# EAGLE schematic Electrical (EAGLE 9.4.0)
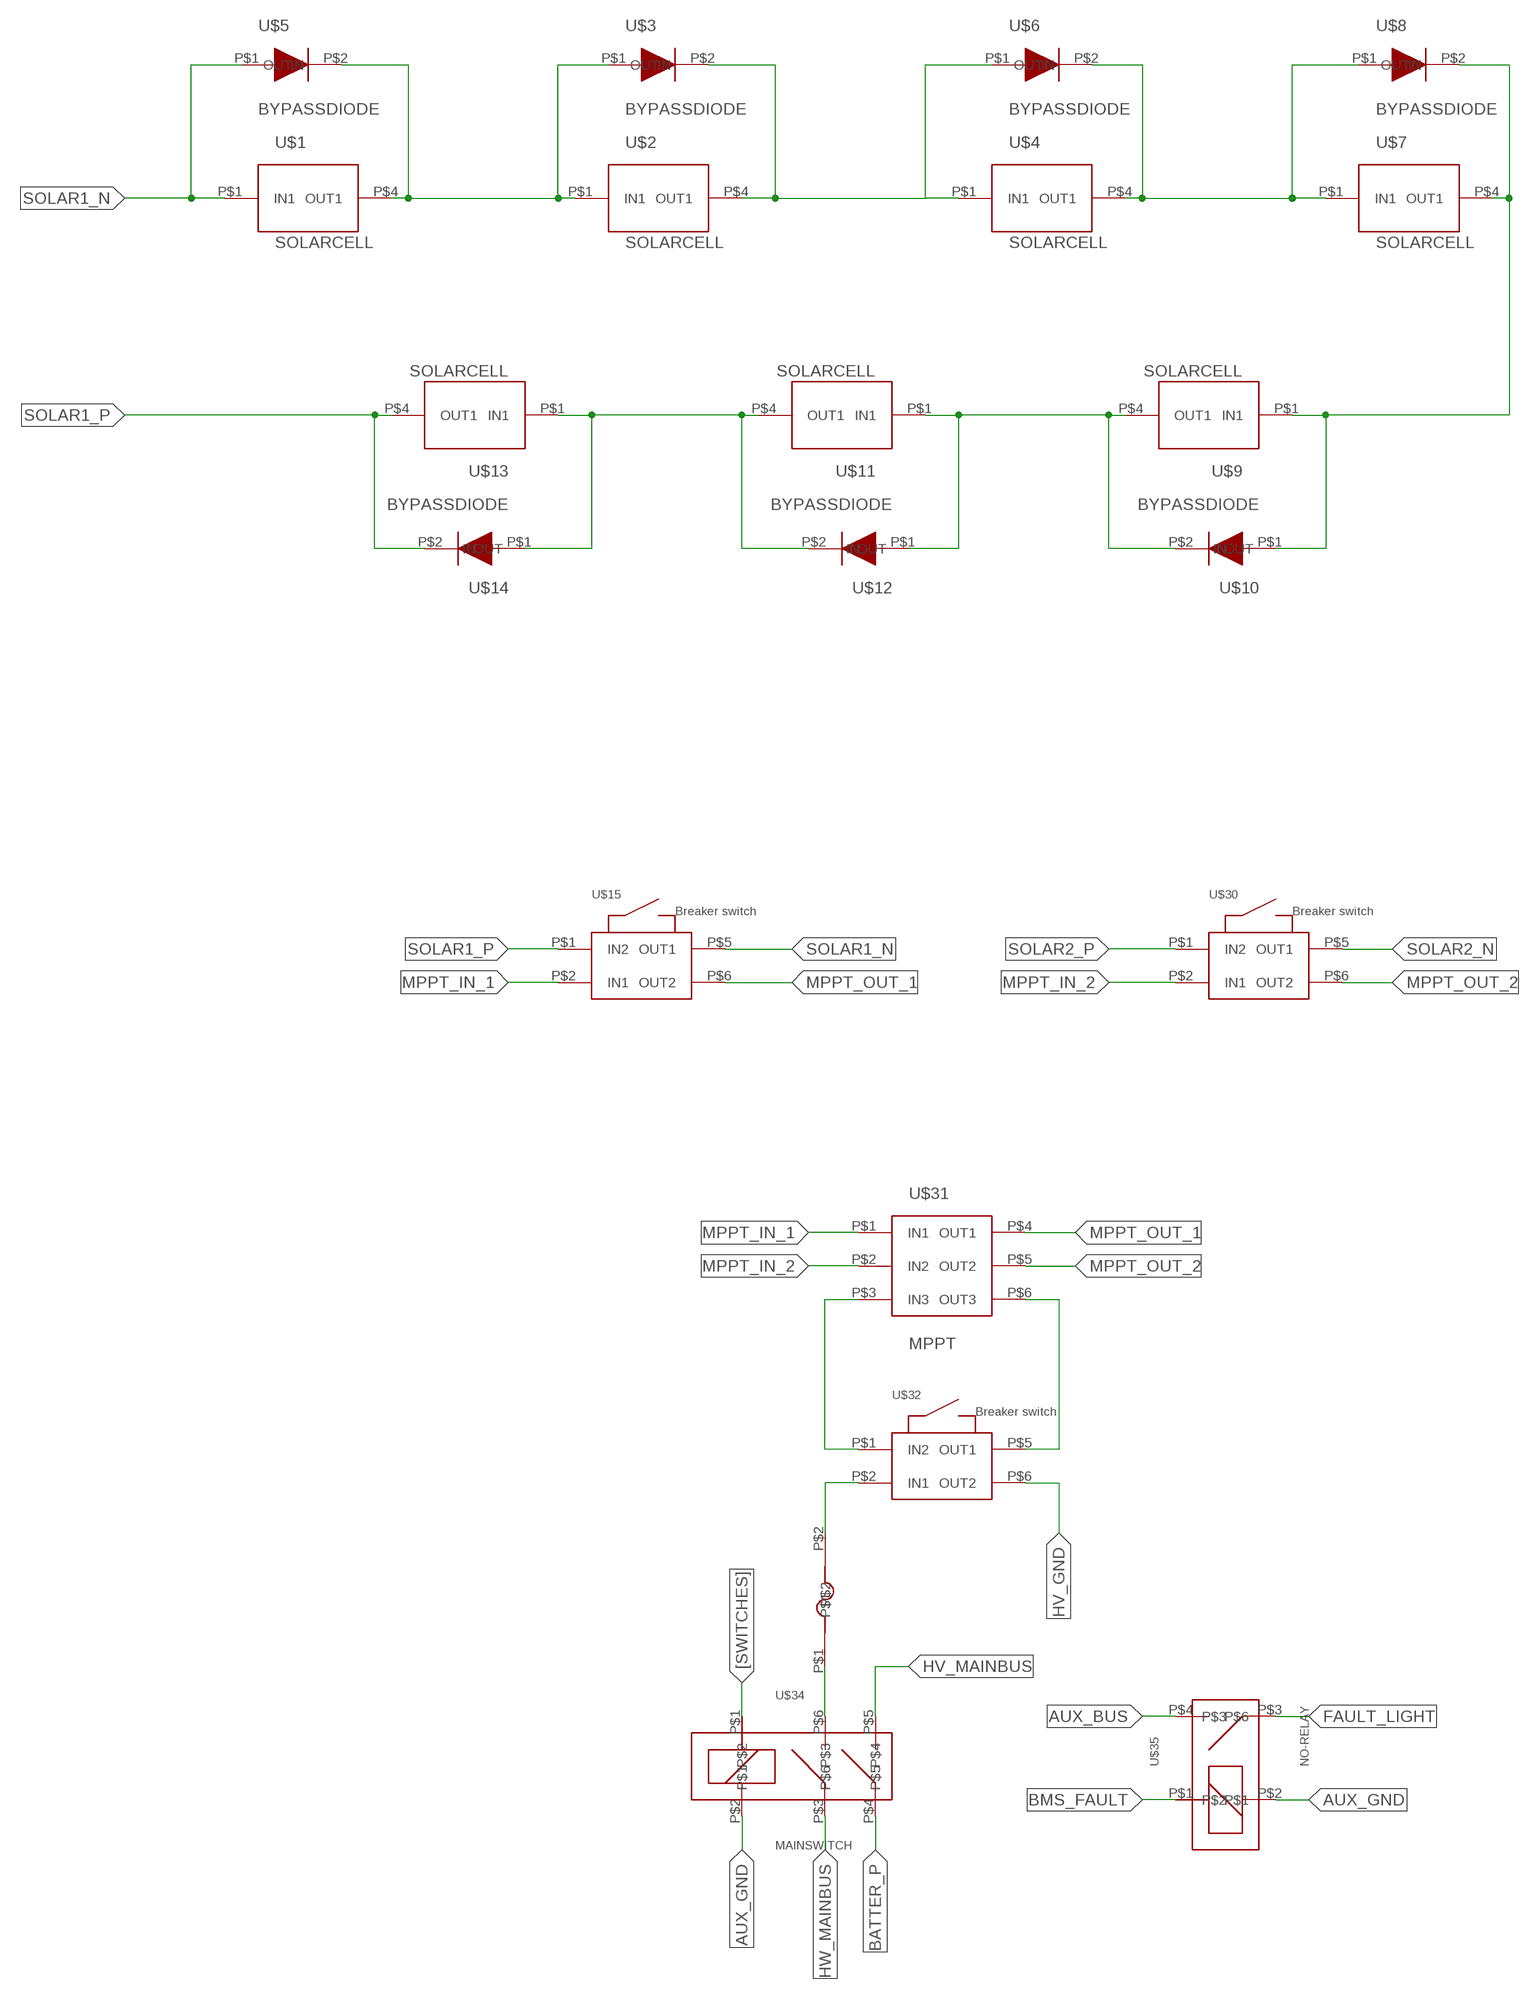
[diagram p0: schematic, sheet 1, part 1 of 3]
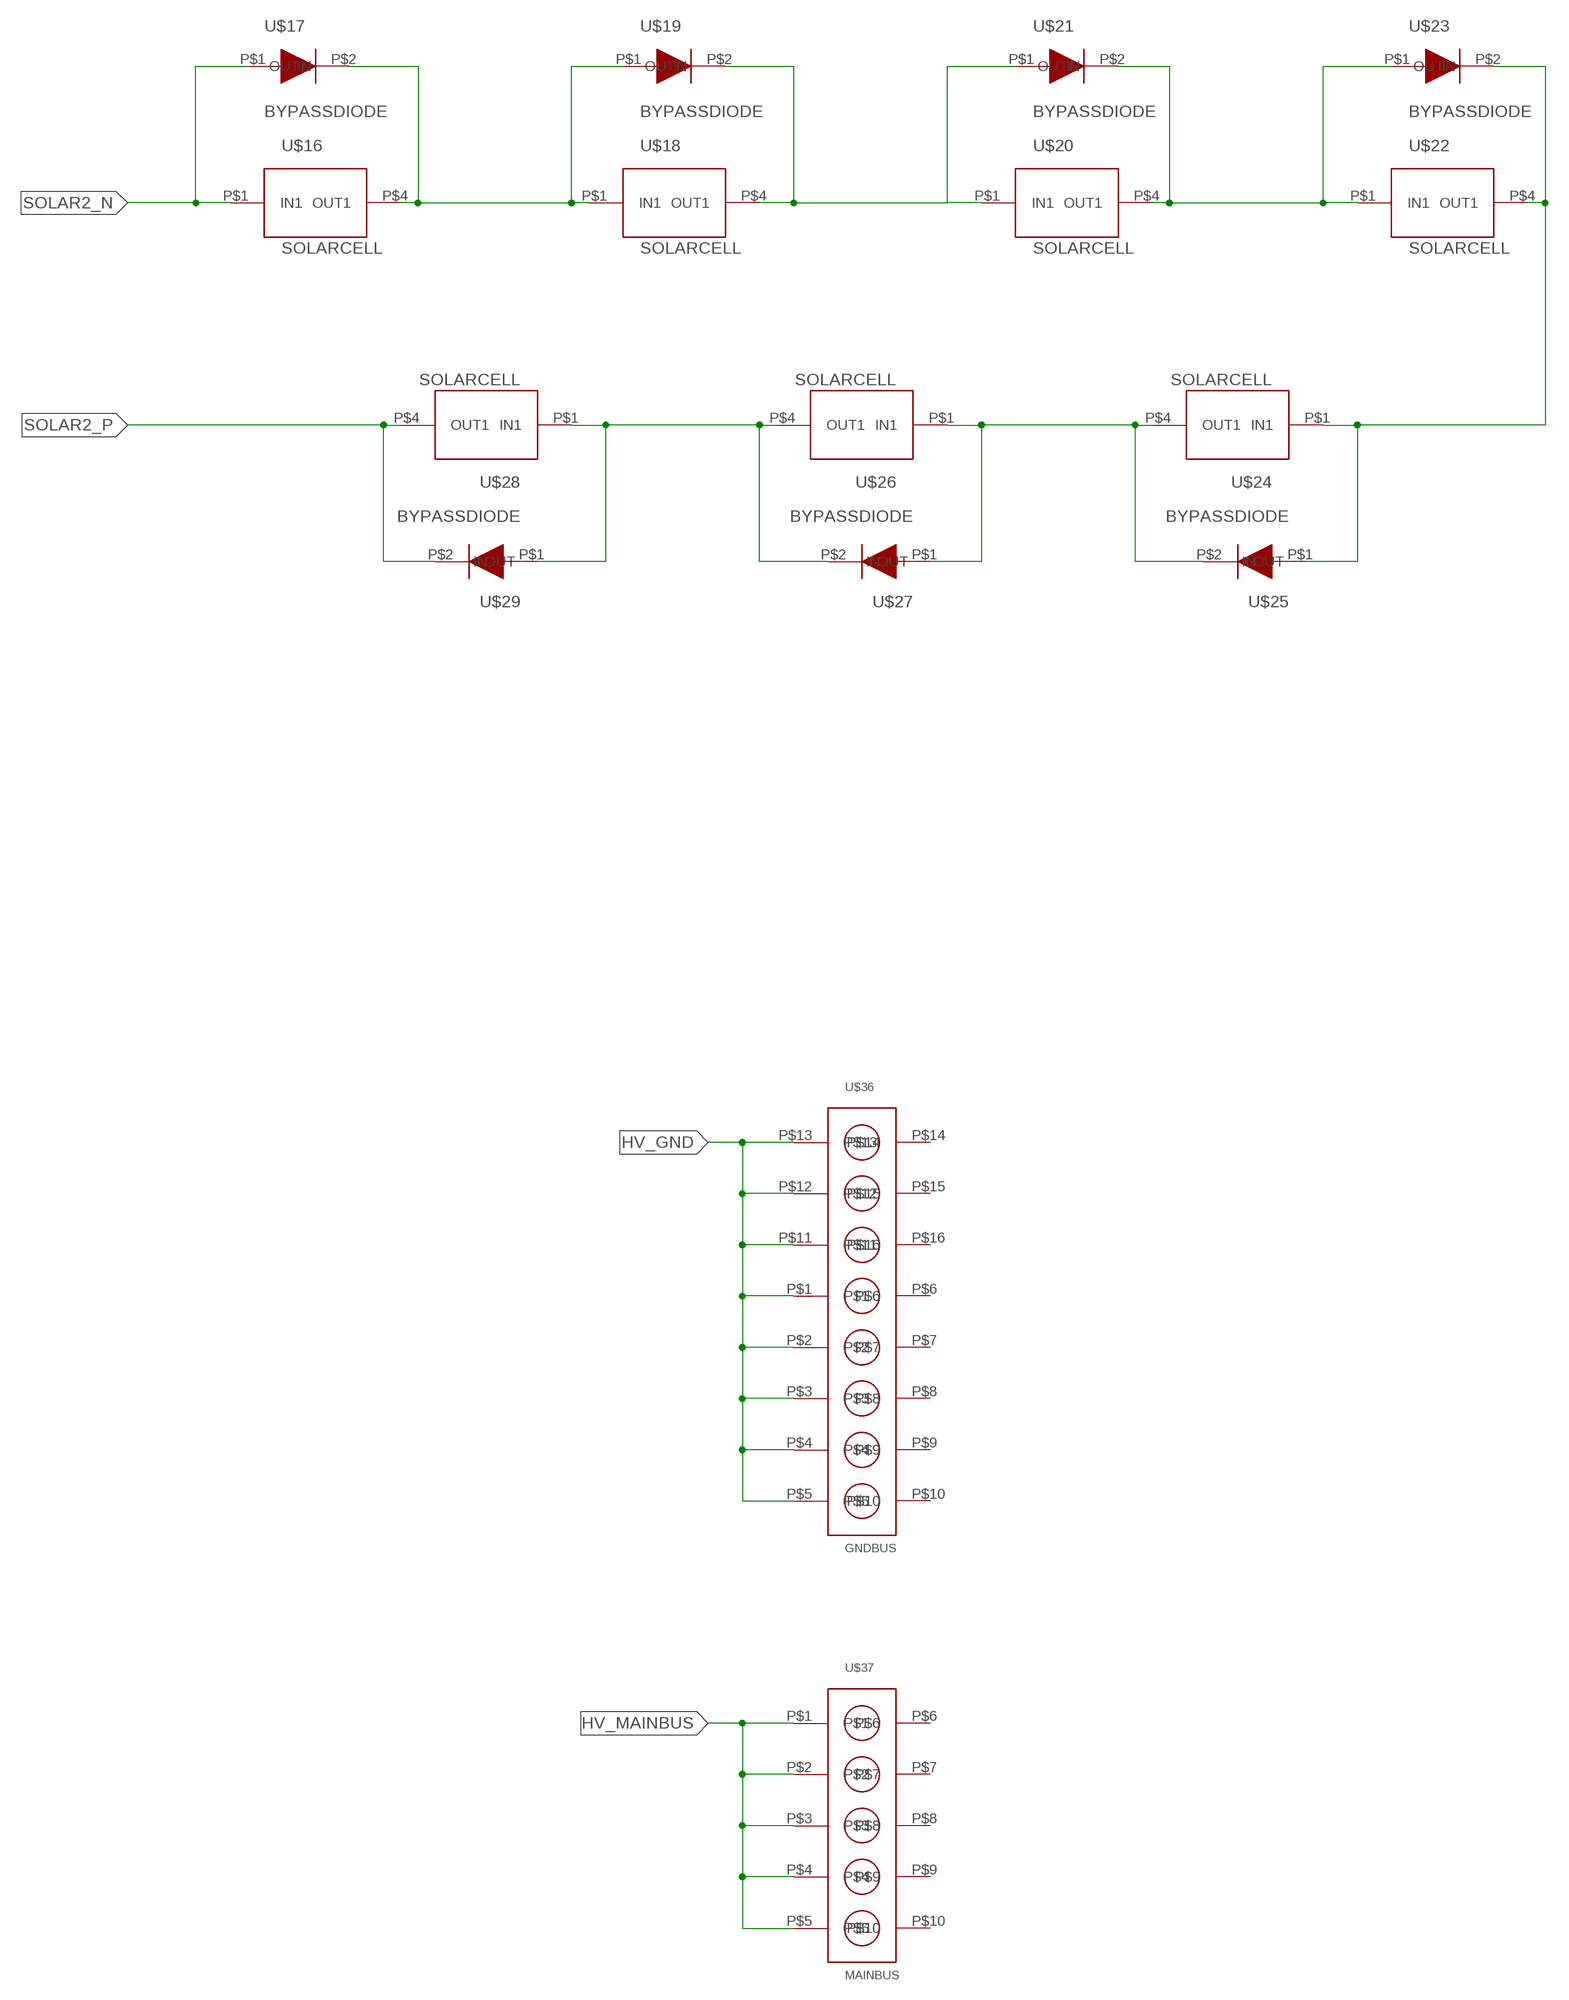
[diagram p1: schematic, sheet 1, part 2 of 3]
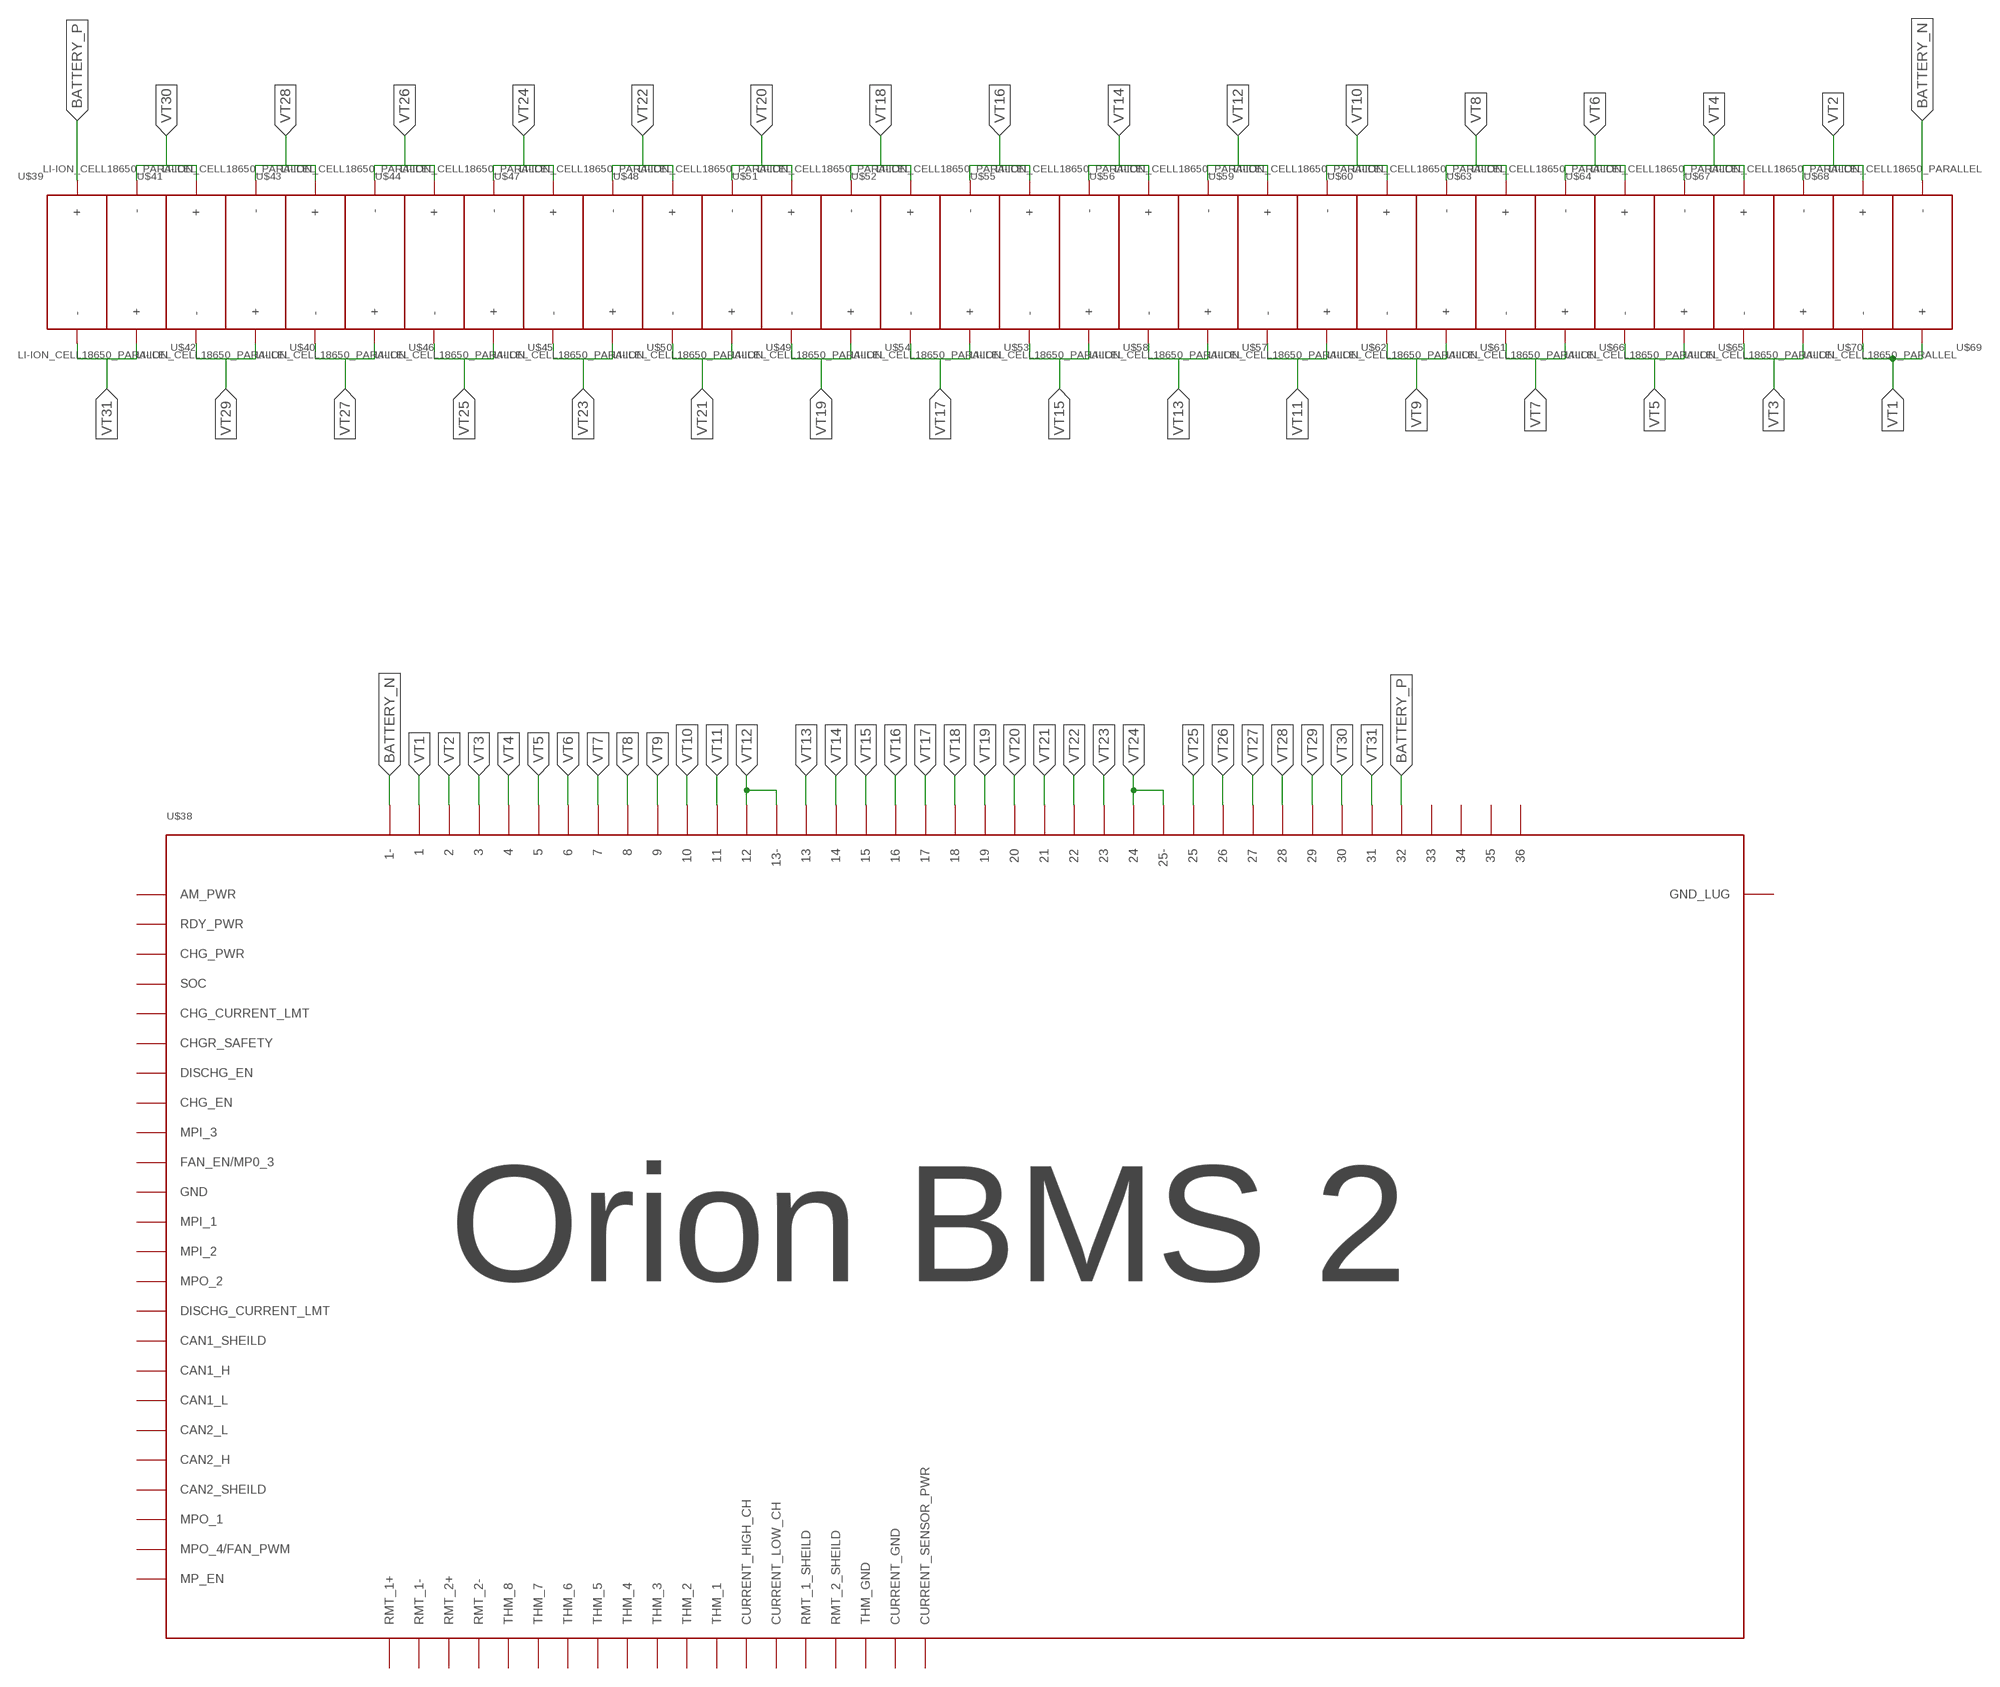
[diagram p2: schematic, sheet 1, part 3 of 3]

## Parts
U$1  SOLARCELL  [SOLARCELL]
U$2  SOLARCELL  [SOLARCELL]
U$3  BYPASSDIODE  [BYPASSDIODE]
U$4  SOLARCELL  [SOLARCELL]
U$5  BYPASSDIODE  [BYPASSDIODE]
U$6  BYPASSDIODE  [BYPASSDIODE]
U$7  SOLARCELL  [SOLARCELL]
U$8  BYPASSDIODE  [BYPASSDIODE]
U$9  SOLARCELL  [SOLARCELL]
U$10  BYPASSDIODE  [BYPASSDIODE]
U$11  SOLARCELL  [SOLARCELL]
U$12  BYPASSDIODE  [BYPASSDIODE]
U$13  SOLARCELL  [SOLARCELL]
U$14  BYPASSDIODE  [BYPASSDIODE]
U$15  CIRCUITBREAKER  [CIRUITBREAKER]
U$16  SOLARCELL  [SOLARCELL]
U$17  BYPASSDIODE  [BYPASSDIODE]
U$18  SOLARCELL  [SOLARCELL]
U$19  BYPASSDIODE  [BYPASSDIODE]
U$20  SOLARCELL  [SOLARCELL]
U$21  BYPASSDIODE  [BYPASSDIODE]
U$22  SOLARCELL  [SOLARCELL]
U$23  BYPASSDIODE  [BYPASSDIODE]
U$24  SOLARCELL  [SOLARCELL]
U$25  BYPASSDIODE  [BYPASSDIODE]
U$26  SOLARCELL  [SOLARCELL]
U$27  BYPASSDIODE  [BYPASSDIODE]
U$28  SOLARCELL  [SOLARCELL]
U$29  BYPASSDIODE  [BYPASSDIODE]
U$30  CIRCUITBREAKER  [CIRUITBREAKER]
U$31  MPPT  [MPPT]
U$32  CIRCUITBREAKER  [CIRUITBREAKER]
U$33  FUSE  [FUSE]
U$34  MAINSWITCH  [MAINSWITCH]
U$35  NO-RELAY  [NO-RELAY]
U$36  GNDBUS  [GNDBUS]
U$37  MAINBUS  [MAINBUS]
U$38  BMSORION_BMS_2  [GNERIC_PADS]
U$39  LI-ION_CELL18650_PARALLEL  [GNERIC_PADS]
U$40  LI-ION_CELL18650_PARALLEL  [GNERIC_PADS]
U$41  LI-ION_CELL18650_PARALLEL  [GNERIC_PADS]
U$42  LI-ION_CELL18650_PARALLEL  [GNERIC_PADS]
U$43  LI-ION_CELL18650_PARALLEL  [GNERIC_PADS]
U$44  LI-ION_CELL18650_PARALLEL  [GNERIC_PADS]
U$45  LI-ION_CELL18650_PARALLEL  [GNERIC_PADS]
U$46  LI-ION_CELL18650_PARALLEL  [GNERIC_PADS]
U$47  LI-ION_CELL18650_PARALLEL  [GNERIC_PADS]
U$48  LI-ION_CELL18650_PARALLEL  [GNERIC_PADS]
U$49  LI-ION_CELL18650_PARALLEL  [GNERIC_PADS]
U$50  LI-ION_CELL18650_PARALLEL  [GNERIC_PADS]
U$51  LI-ION_CELL18650_PARALLEL  [GNERIC_PADS]
U$52  LI-ION_CELL18650_PARALLEL  [GNERIC_PADS]
U$53  LI-ION_CELL18650_PARALLEL  [GNERIC_PADS]
U$54  LI-ION_CELL18650_PARALLEL  [GNERIC_PADS]
U$55  LI-ION_CELL18650_PARALLEL  [GNERIC_PADS]
U$56  LI-ION_CELL18650_PARALLEL  [GNERIC_PADS]
U$57  LI-ION_CELL18650_PARALLEL  [GNERIC_PADS]
U$58  LI-ION_CELL18650_PARALLEL  [GNERIC_PADS]
U$59  LI-ION_CELL18650_PARALLEL  [GNERIC_PADS]
U$60  LI-ION_CELL18650_PARALLEL  [GNERIC_PADS]
U$61  LI-ION_CELL18650_PARALLEL  [GNERIC_PADS]
U$62  LI-ION_CELL18650_PARALLEL  [GNERIC_PADS]
U$63  LI-ION_CELL18650_PARALLEL  [GNERIC_PADS]
U$64  LI-ION_CELL18650_PARALLEL  [GNERIC_PADS]
U$65  LI-ION_CELL18650_PARALLEL  [GNERIC_PADS]
U$66  LI-ION_CELL18650_PARALLEL  [GNERIC_PADS]
U$67  LI-ION_CELL18650_PARALLEL  [GNERIC_PADS]
U$68  LI-ION_CELL18650_PARALLEL  [GNERIC_PADS]
U$69  LI-ION_CELL18650_PARALLEL  [GNERIC_PADS]
U$70  LI-ION_CELL18650_PARALLEL  [GNERIC_PADS]

## Nets
[SWITCHES]: U$34.P$1
AUX_BUS: U$35.P$4
AUX_GND: U$34.P$2 U$35.P$2
BATTER_P: U$34.P$4
BATTERY_N: U$38.P$2(1-) U$69.P$2(-)
BATTERY_P: U$38.P$35 U$39.P$1(+)
BMS_FAULT: U$35.P$1
FAULT_LIGHT: U$35.P$3
HV_GND: U$32.P$6(OUT2) U$36.P$1 U$36.P$2 U$36.P$3 U$36.P$4 U$36.P$5 U$36.P$11 U$36.P$12 U$36.P$13
HV_MAINBUS: U$34.P$5 U$37.P$1 U$37.P$2 U$37.P$3 U$37.P$4 U$37.P$5
HW_MAINBUS: U$34.P$3
MPPT_IN_1: U$15.P$2(IN1) U$31.P$1(IN1)
MPPT_IN_2: U$30.P$2(IN1) U$31.P$2(IN2)
MPPT_OUT_1: U$15.P$6(OUT2) U$31.P$4(OUT1)
MPPT_OUT_2: U$30.P$6(OUT2) U$31.P$5(OUT2)
N$1: U$16.P$4(OUT1) U$17.P$2(OUT) U$18.P$1(IN1) U$19.P$1(IN)
N$2: U$1.P$4(OUT1) U$2.P$1(IN1) U$3.P$1(IN) U$5.P$2(OUT)
N$3: U$18.P$4(OUT1) U$19.P$2(OUT) U$20.P$1(IN1) U$21.P$1(IN)
N$4: U$2.P$4(OUT1) U$3.P$2(OUT) U$4.P$1(IN1) U$6.P$1(IN)
N$5: U$20.P$4(OUT1) U$21.P$2(OUT) U$22.P$1(IN1) U$23.P$1(IN)
N$6: U$4.P$4(OUT1) U$6.P$2(OUT) U$7.P$1(IN1) U$8.P$1(IN)
N$7: U$22.P$4(OUT1) U$23.P$2(OUT) U$24.P$1(IN1) U$25.P$1(IN)
N$8: U$7.P$4(OUT1) U$8.P$2(OUT) U$9.P$1(IN1) U$10.P$1(IN)
N$9: U$24.P$4(OUT1) U$25.P$2(OUT) U$26.P$1(IN1) U$27.P$1(IN)
N$10: U$9.P$4(OUT1) U$10.P$2(OUT) U$11.P$1(IN1) U$12.P$1(IN)
N$11: U$26.P$4(OUT1) U$27.P$2(OUT) U$28.P$1(IN1) U$29.P$1(IN)
N$12: U$11.P$4(OUT1) U$12.P$2(OUT) U$13.P$1(IN1) U$14.P$1(IN)
N$13: U$31.P$3(IN3) U$32.P$1(IN2)
N$14: U$31.P$6(OUT3) U$32.P$5(OUT1)
N$15: U$39.P$2(-) U$42.P$1(+)
N$16: U$33.P$1 U$34.P$6
N$17: U$32.P$2(IN1) U$33.P$2
N$18: U$40.P$1(+) U$41.P$2(-)
N$19: U$41.P$1(+) U$42.P$2(-)
N$20: U$40.P$2(-) U$43.P$1(+)
N$21: U$43.P$2(-) U$46.P$1(+)
N$22: U$44.P$2(-) U$45.P$1(+)
N$23: U$44.P$1(+) U$46.P$2(-)
N$24: U$45.P$2(-) U$47.P$1(+)
N$25: U$47.P$2(-) U$50.P$1(+)
N$26: U$48.P$2(-) U$49.P$1(+)
N$27: U$48.P$1(+) U$50.P$2(-)
N$28: U$49.P$2(-) U$51.P$1(+)
N$29: U$51.P$2(-) U$54.P$1(+)
N$30: U$52.P$2(-) U$53.P$1(+)
N$31: U$52.P$1(+) U$54.P$2(-)
N$32: U$53.P$2(-) U$55.P$1(+)
N$33: U$55.P$2(-) U$58.P$1(+)
N$34: U$56.P$2(-) U$57.P$1(+)
N$35: U$56.P$1(+) U$58.P$2(-)
N$36: U$57.P$2(-) U$59.P$1(+)
N$37: U$59.P$2(-) U$62.P$1(+)
N$38: U$60.P$2(-) U$61.P$1(+)
N$39: U$60.P$1(+) U$62.P$2(-)
N$40: U$61.P$2(-) U$63.P$1(+)
N$41: U$63.P$2(-) U$66.P$1(+)
N$42: U$64.P$2(-) U$65.P$1(+)
N$43: U$64.P$1(+) U$66.P$2(-)
N$44: U$65.P$2(-) U$67.P$1(+)
N$45: U$67.P$2(-) U$70.P$1(+)
N$47: U$68.P$1(+) U$70.P$2(-)
SOLAR1_N: U$1.P$1(IN1) U$5.P$1(IN) U$15.P$5(OUT1)
SOLAR1_P: U$13.P$4(OUT1) U$14.P$2(OUT) U$15.P$1(IN2)
SOLAR2_N: U$16.P$1(IN1) U$17.P$1(IN) U$30.P$5(OUT1)
SOLAR2_P: U$28.P$4(OUT1) U$29.P$2(OUT) U$30.P$1(IN2)
VT1: U$38.P$1 U$68.P$2(-) U$69.P$1(+)
VT2: U$38.P$3
VT3: U$38.P$4
VT4: U$38.P$5
VT5: U$38.P$6
VT6: U$38.P$7
VT7: U$38.P$8
VT8: U$38.P$9
VT9: U$38.P$10
VT10: U$38.P$11
VT11: U$38.P$12
VT12: U$38.P$13 U$38.P$15(13-)
VT13: U$38.P$14
VT14: U$38.P$16
VT15: U$38.P$17
VT16: U$38.P$18
VT17: U$38.P$19
VT18: U$38.P$20
VT19: U$38.P$21
VT20: U$38.P$22
VT21: U$38.P$23
VT22: U$38.P$24
VT23: U$38.P$25
VT24: U$38.P$26 U$38.P$28(25-)
VT25: U$38.P$27
VT26: U$38.P$29
VT27: U$38.P$30
VT28: U$38.P$31
VT29: U$38.P$32
VT30: U$38.P$33
VT31: U$38.P$34
Unconnected: U$36.P$6 U$36.P$7 U$36.P$8 U$36.P$9 U$36.P$10 U$36.P$14 U$36.P$15 U$36.P$16 U$37.P$6 U$37.P$7 U$37.P$8 U$37.P$9 U$37.P$10 U$38.P$36 U$38.P$37 U$38.P$38 U$38.P$39 U$38.P$40(AM_PWR) U$38.P$41(CAN1_H) U$38.P$42(CAN1_L) U$38.P$43(CAN1_SHEILD) U$38.P$44(CAN2_H) U$38.P$45(CAN2_L) U$38.P$46(CAN2_SHEILD) U$38.P$47(CHGR_SAFETY) U$38.P$48(CHG_CURRENT_LMT) U$38.P$49(CHG_EN) U$38.P$50(CHG_PWR) U$38.P$51(CURRENT_GND) U$38.P$52(CURRENT_HIGH_CH) U$38.P$53(CURRENT_LOW_CH) U$38.P$54(CURRENT_SENSOR_PWR) U$38.P$55(DISCHG_CURRENT_LMT) U$38.P$56(DISCHG_EN) U$38.P$57(FAN_EN/MP0_3) U$38.P$58(GND) U$38.P$59(GND_LUG) U$38.P$60(MPI_1) U$38.P$61(MPI_2) U$38.P$62(MPI_3) U$38.P$63(MPO_1) U$38.P$64(MPO_2) U$38.P$65(MPO_4/FAN_PWM) U$38.P$66(MP_EN) U$38.P$67(RDY_PWR) U$38.P$68(RMT_1+) U$38.P$69(RMT_1-) U$38.P$70(RMT_1_SHEILD) U$38.P$71(RMT_2+) U$38.P$72(RMT_2-) U$38.P$73(RMT_2_SHEILD) U$38.P$74(SOC) U$38.P$75(THM_1) U$38.P$76(THM_2) U$38.P$77(THM_3) U$38.P$78(THM_4) U$38.P$79(THM_5) U$38.P$80(THM_6) U$38.P$81(THM_7) U$38.P$82(THM_8) U$38.P$83(THM_GND)

## Library data of the parts
U$1 U$2 U$4 U$7 U$9 U$11 U$13 U$16 U$18 U$20 U$22 U$24 U$26 U$28 = Solar array design :SOLARCELL: solar team library - FALL 2018 Design FALL 2018 Solar Cells: Sunpower C60 Kpr Website: https://us.sunpower.com/sites/sunpower/files/media-library/spec-sheets/sp-sunpower-maxeon-solar-cells-gen2.pdf
U$3 U$5 U$6 U$8 U$10 U$12 U$14 U$17 U$19 U$21 U$23 U$25 U$27 U$29 = Solar array design :BYPASSDIODE: solar team library - FALL 2018 Design FALL 2018 Bypass Diode
U$15 U$30 U$32 = Solar array design :CIRCUITBREAKER: [ - UCI Solar Car - FALL 2018 Design- FALL 2018 Mini circiut Breaker
U$31 = Solar array design :MPPT: solar team library - FALL 2018 Design fall 2018 1) MPPT: Photon 3 Website: https://www.dilithiumpower.com/products/photon-3
U$33 = Solar array design :FUSE: solar team library - FALL 2018 Design FALL 2018 Fuse
U$34 = Solar array design :MAINSWITCH
U$35 = Solar array design :NO-RELAY: solar team library - FALL 2018 Design FALL 2018 NO relay
U$36 = Solar array design :GNDBUS: solar team library - FALL 2018 Design FALL 2018 Vehicle GND Bus
U$37 = Solar array design :MAINBUS: solar team library - FALL 2018 Design FALL 2018 Main Bus
U$38 = Battery:BMS: Orion BMS 2
U$39-U$70 = Battery:LI-ION_CELL: Li-Ion cells connected in parallel